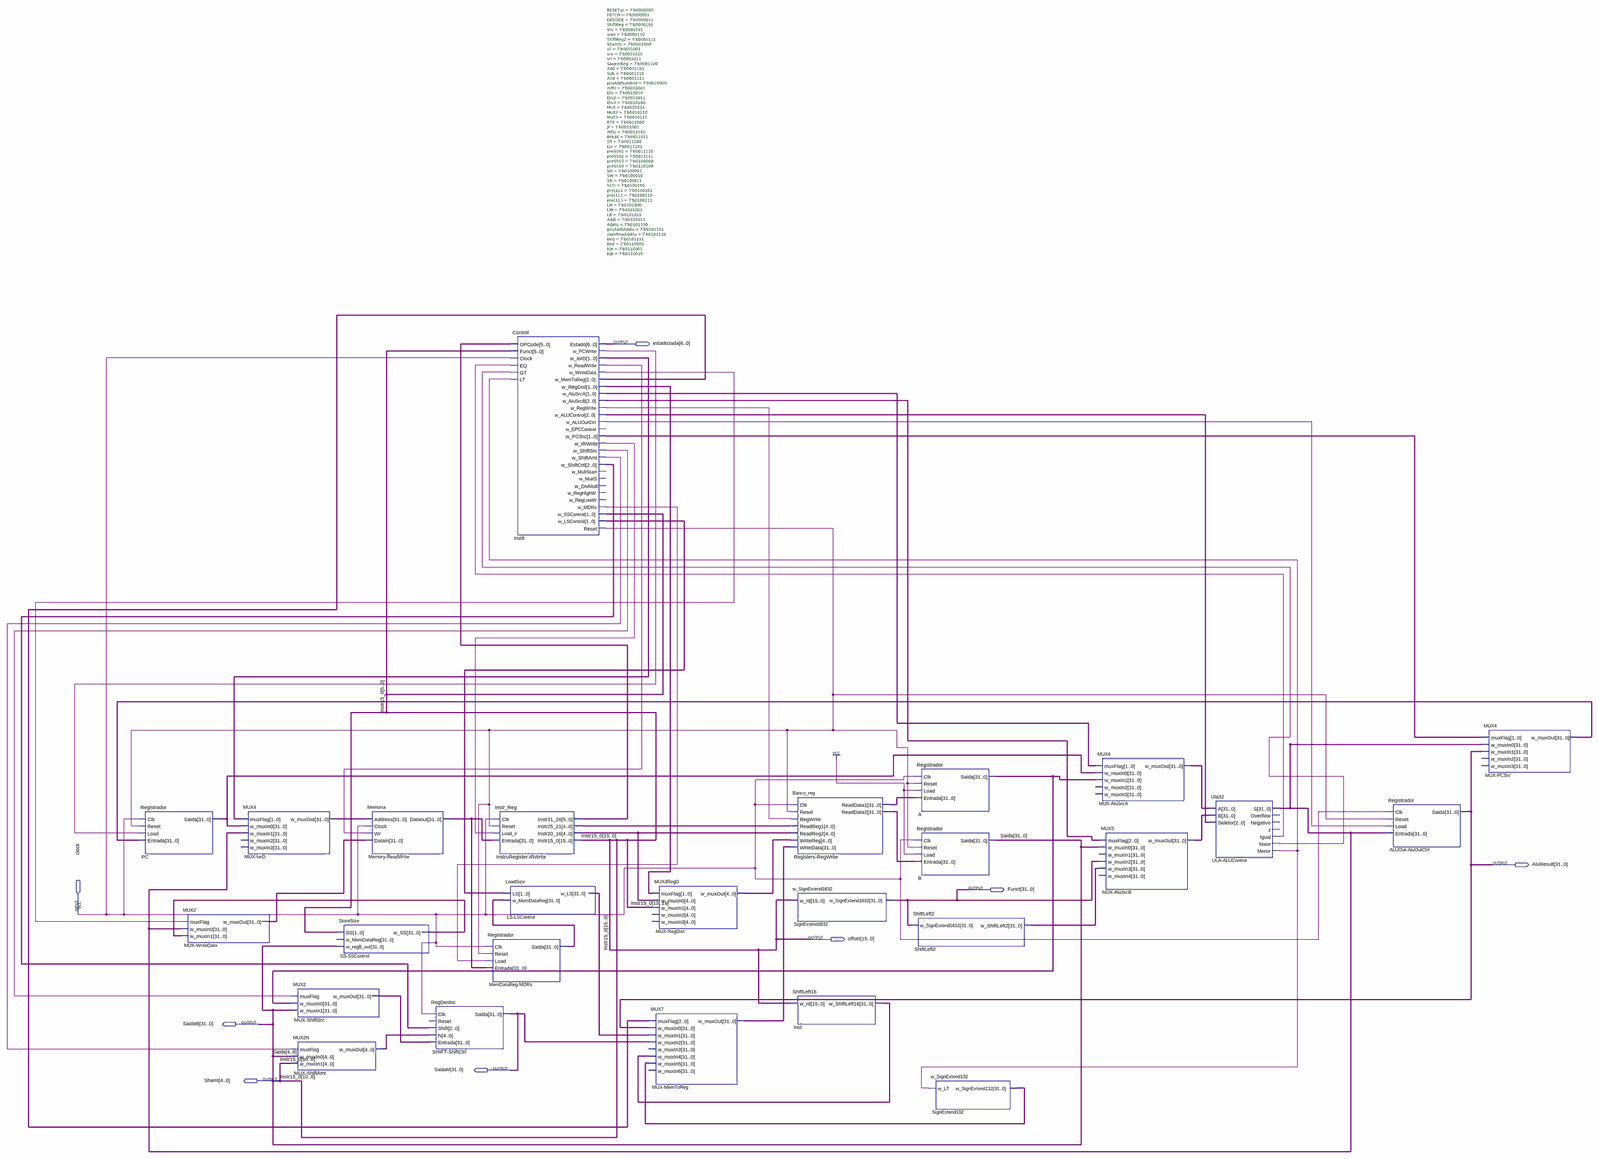
[diagram p0: schematic sheet, whole]
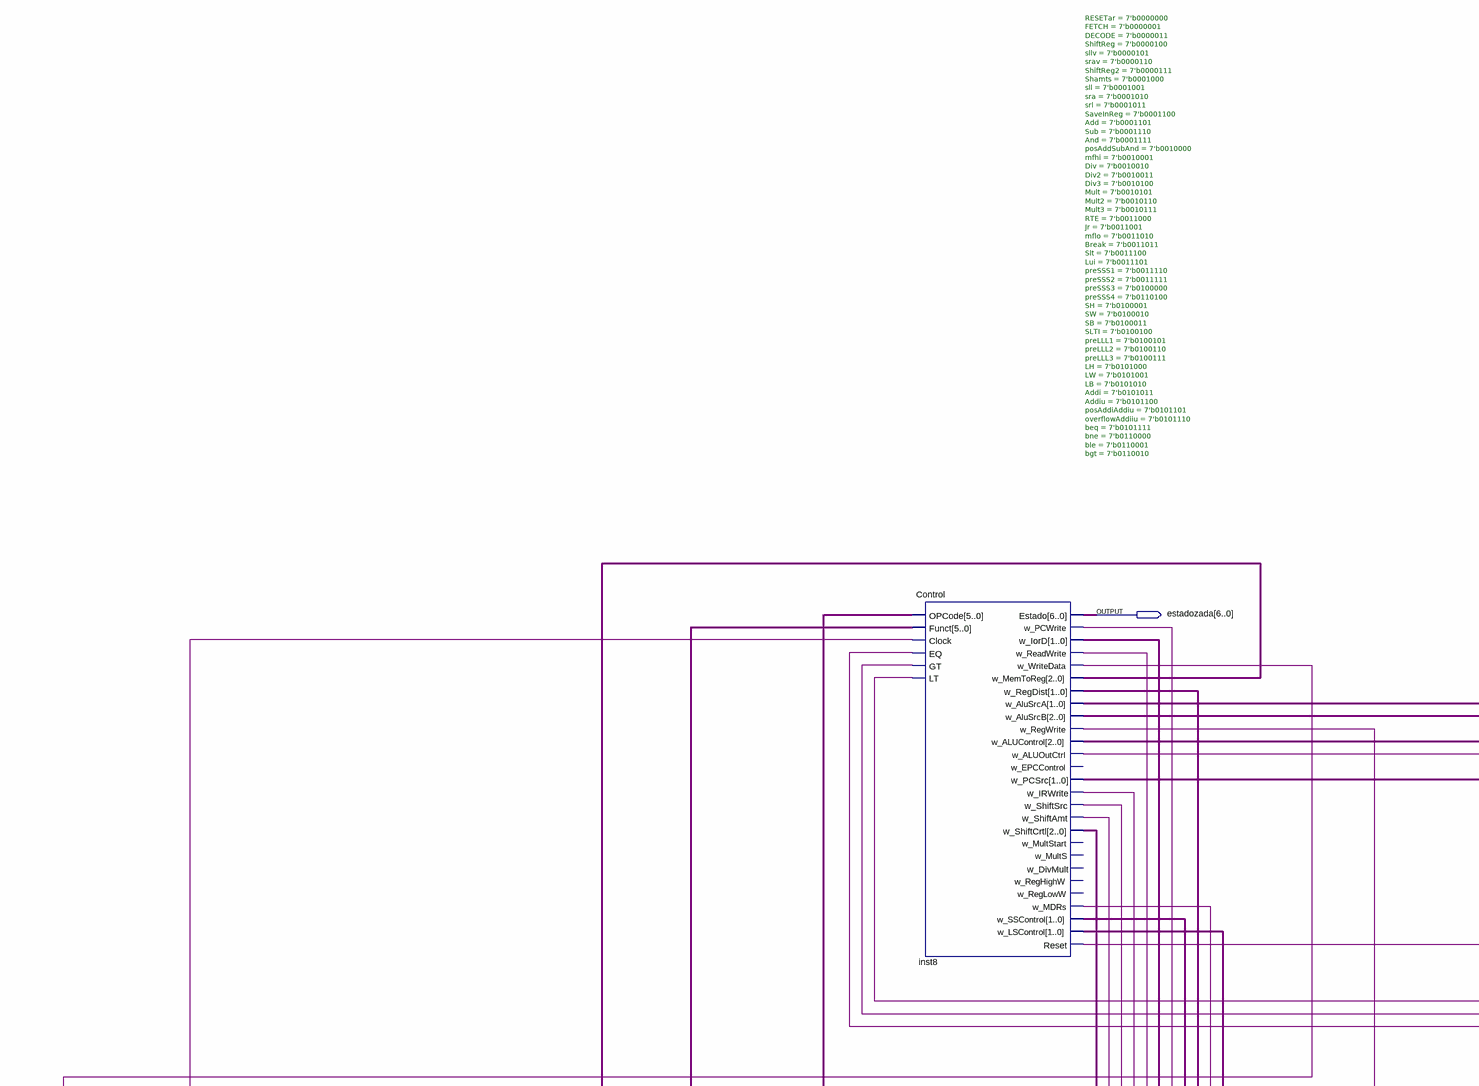
[diagram p1: schematic sheet, upper left part]
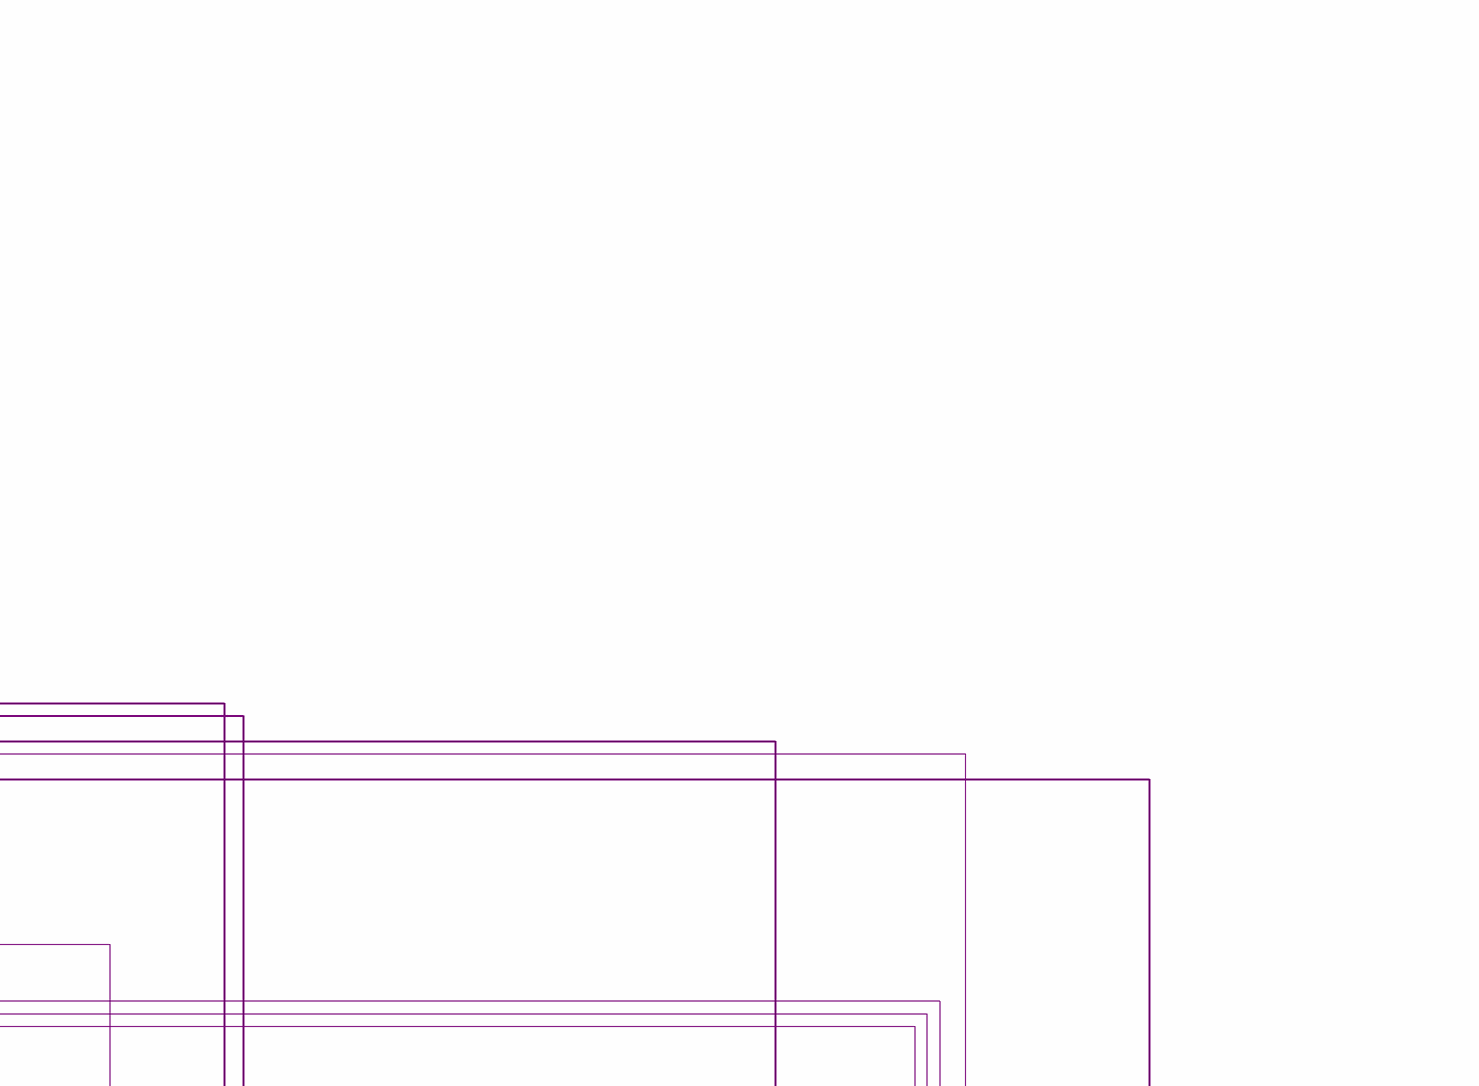
[diagram p2: schematic sheet, upper right part]
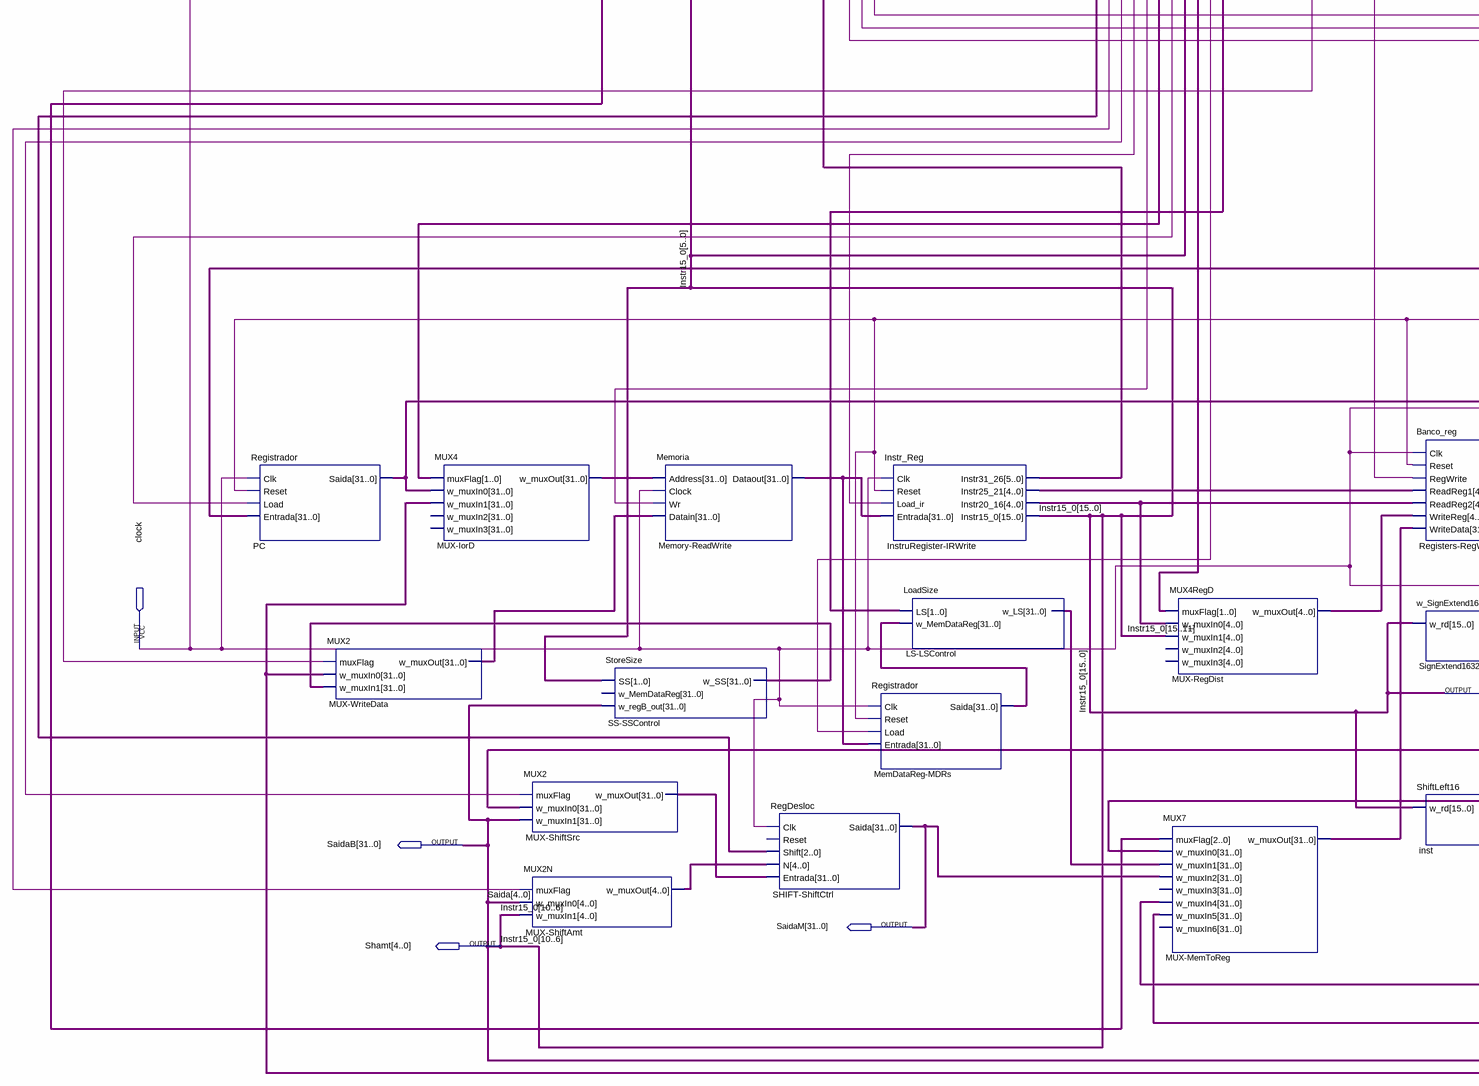
[diagram p3: schematic sheet, lower left part]
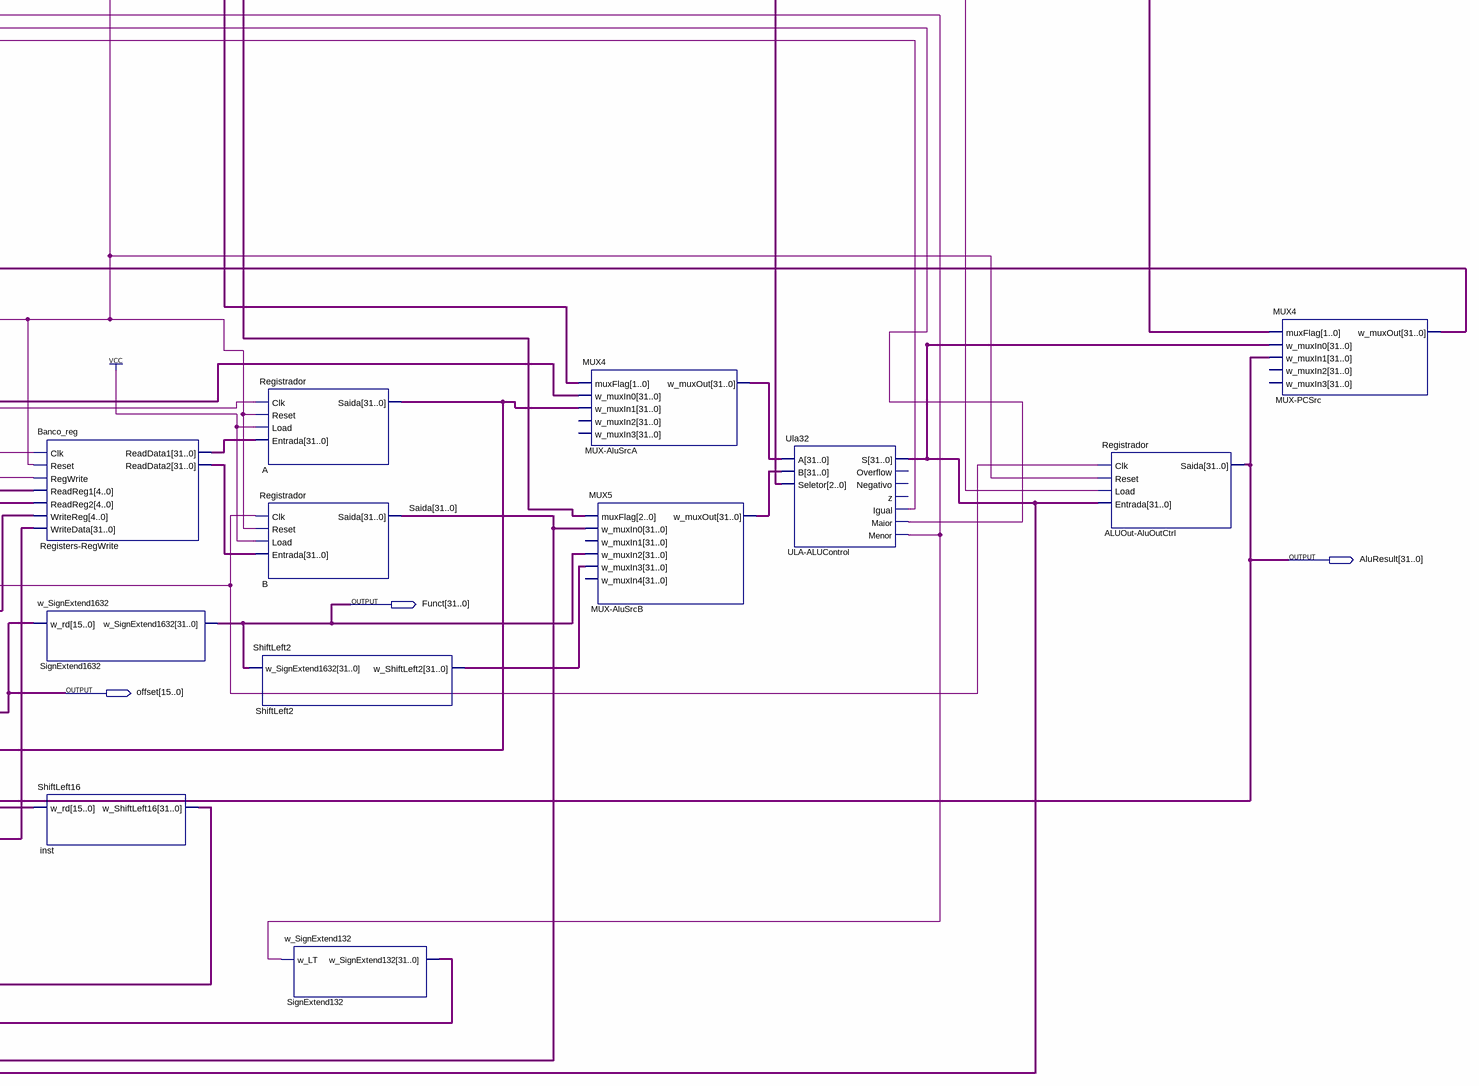
[diagram p4: schematic sheet, lower right part]
// Quartus schematic CPUbloco - Copia.bdf as structural Verilog: 26 symbols, 8 pins
module \CPUbloco_-_Copia  (
  input  clock,
  output [6:0] estadozada,
  output [31:0] AluResult,
  output [31:0] Funct,
  output [15:0] offset,
  output [31:0] SaidaB,
  output [31:0] SaidaM,
  output [4:0] Shamt
);

  wire inst8_reset, inst8_w_aluoutctrl, inst8_w_irwrite, inst8_w_mdrs, inst8_w_pcwrite, inst8_w_readwrite,
       inst8_w_regwrite, inst8_w_shiftamt, inst8_w_shiftsrc, inst8_w_writedata, ULA_ALUControl_igual,
       ULA_ALUControl_maior, ULA_ALUControl_menor;
  wire [1:0] inst8_w_alusrca, inst8_w_iord, inst8_w_lscontrol, inst8_w_pcsrc, inst8_w_regdist;
  wire [2:0] inst8_w_alucontrol, inst8_w_alusrcb, inst8_w_memtoreg, inst8_w_shiftcrtl;
  wire [4:0] InstruRegister_IRWrite_instr20_16, InstruRegister_IRWrite_instr25_21, MUX_RegDist_w_muxout,
       MUX_ShiftAmt_w_muxout;
  wire [5:0] InstruRegister_IRWrite_instr31_26;
  wire [31:0] A_saida, inst_w_shiftleft16, LS_LSControl_w_ls, MemDataReg_MDRs_saida,
       Memory_ReadWrite_dataout, MUX_AluSrcA_w_muxout, MUX_AluSrcB_w_muxout, MUX_IorD_w_muxout,
       MUX_MemToReg_w_muxout, MUX_PCSrc_w_muxout, MUX_ShiftSrc_w_muxout, MUX_WriteData_w_muxout, PC_saida,
       Registers_RegWrite_readdata1, Registers_RegWrite_readdata2, ShiftLeft2_w_shiftleft2,
       SignExtend132_w_signextend132, SS_SSControl_w_ss, ULA_ALUControl_s;

  Registrador PC (
    .Clk(clock), .Reset(inst8_reset), .Load(inst8_w_pcwrite), .Entrada(MUX_PCSrc_w_muxout), .Saida(PC_saida));
  MUX2 \MUX-WriteData  (
    .muxFlag(inst8_w_writedata), .w_muxIn0(ULA_ALUControl_s), .w_muxIn1(SS_SSControl_w_ss),
    .w_muxOut(MUX_WriteData_w_muxout));
  MUX4 \MUX-IorD  (
    .muxFlag(inst8_w_iord), .w_muxIn0(PC_saida), .w_muxIn1(ULA_ALUControl_s), .w_muxOut(MUX_IorD_w_muxout));  // open: w_muxIn2, w_muxIn3
  MUX2 \MUX-ShiftSrc  (
    .muxFlag(inst8_w_shiftsrc), .w_muxIn0(A_saida), .w_muxIn1(SaidaB), .w_muxOut(MUX_ShiftSrc_w_muxout));
  MUX2N \MUX-ShiftAmt  (
    .muxFlag(inst8_w_shiftamt), .w_muxIn0(SaidaB[4:0]), .w_muxIn1(offset[10:6]),
    .w_muxOut(MUX_ShiftAmt_w_muxout));
  StoreSize \SS-SSControl  (.SS(offset), .w_regB_out(SaidaB), .w_SS(SS_SSControl_w_ss));  // open: w_MemDataReg
  Memoria \Memory-ReadWrite  (
    .Address(MUX_IorD_w_muxout), .Clock(clock), .Wr(inst8_w_readwrite), .Datain(MUX_WriteData_w_muxout),
    .Dataout(Memory_ReadWrite_dataout));
  RegDesloc \SHIFT-ShiftCtrl  (
    .Clk(clock), .Shift(inst8_w_shiftcrtl), .N(MUX_ShiftAmt_w_muxout), .Entrada(MUX_ShiftSrc_w_muxout),
    .Saida(SaidaM));  // open: Reset
  Instr_Reg \InstruRegister-IRWrite  (
    .Clk(clock), .Reset(inst8_reset), .Load_ir(inst8_w_irwrite), .Entrada(Memory_ReadWrite_dataout),
    .Instr31_26(InstruRegister_IRWrite_instr31_26), .Instr25_21(InstruRegister_IRWrite_instr25_21),
    .Instr20_16(InstruRegister_IRWrite_instr20_16), .Instr15_0(offset));
  LoadSize \LS-LSControl  (.LS(inst8_w_lscontrol), .w_MemDataReg(MemDataReg_MDRs_saida), .w_LS(LS_LSControl_w_ls));
  Registrador \MemDataReg-MDRs  (
    .Clk(clock), .Reset(inst8_reset), .Load(inst8_w_mdrs), .Entrada(Memory_ReadWrite_dataout),
    .Saida(MemDataReg_MDRs_saida));
  Control #(.RESETar(7'b0000000), .FETCH(7'b0000001), .DECODE(7'b0000011), .ShiftReg(7'b0000100), .sllv(7'b0000101), .srav(7'b0000110), .ShiftReg2(7'b0000111), .Shamts(7'b0001000), .sll(7'b0001001), .sra(7'b0001010), .srl(7'b0001011), .SaveInReg(7'b0001100), .Add(7'b0001101), .Sub(7'b0001110), .And(7'b0001111), .posAddSubAnd(7'b0010000), .mfhi(7'b0010001), .Div(7'b0010010), .Div2(7'b0010011), .Div3(7'b0010100), .Mult(7'b0010101), .Mult2(7'b0010110), .Mult3(7'b0010111), .RTE(7'b0011000), .Jr(7'b0011001), .mflo(7'b0011010), .Break(7'b0011011), .Slt(7'b0011100), .Lui(7'b0011101), .preSSS1(7'b0011110), .preSSS2(7'b0011111), .preSSS3(7'b0100000), .preSSS4(7'b0110100), .SH(7'b0100001), .SW(7'b0100010), .SB(7'b0100011), .SLTI(7'b0100100), .preLLL1(7'b0100101), .preLLL2(7'b0100110), .preLLL3(7'b0100111), .LH(7'b0101000), .LW(7'b0101001), .LB(7'b0101010), .Addi(7'b0101011), .Addiu(7'b0101100), .posAddiAddiu(7'b0101101), .overflowAddiiu(7'b0101110), .beq(7'b0101111), .bne(7'b0110000), .ble(7'b0110001), .bgt(7'b0110010)) inst8 (
    .OPCode(InstruRegister_IRWrite_instr31_26), .Funct(offset[5:0]), .Clock(clock),
    .EQ(ULA_ALUControl_igual), .GT(ULA_ALUControl_maior), .LT(ULA_ALUControl_menor), .Estado(estadozada),
    .w_PCWrite(inst8_w_pcwrite), .w_IorD(inst8_w_iord), .w_ReadWrite(inst8_w_readwrite),
    .w_WriteData(inst8_w_writedata), .w_MemToReg(inst8_w_memtoreg), .w_RegDist(inst8_w_regdist),
    .w_AluSrcA(inst8_w_alusrca), .w_AluSrcB(inst8_w_alusrcb), .w_RegWrite(inst8_w_regwrite),
    .w_ALUControl(inst8_w_alucontrol), .w_ALUOutCtrl(inst8_w_aluoutctrl), .w_PCSrc(inst8_w_pcsrc),
    .w_IRWrite(inst8_w_irwrite), .w_ShiftSrc(inst8_w_shiftsrc), .w_ShiftAmt(inst8_w_shiftamt),
    .w_ShiftCrtl(inst8_w_shiftcrtl), .w_MDRs(inst8_w_mdrs), .w_SSControl(offset[5:0]),
    .w_LSControl(inst8_w_lscontrol), .Reset(inst8_reset));  // open: w_EPCControl, w_MultStart, w_MultS, w_DivMult, w_RegHighW, w_RegLowW
  MUX4RegD \MUX-RegDist  (
    .muxFlag(inst8_w_regdist), .w_muxIn0(InstruRegister_IRWrite_instr20_16), .w_muxIn1(offset[15:11]),
    .w_muxOut(MUX_RegDist_w_muxout));  // open: w_muxIn2, w_muxIn3
  MUX7 \MUX-MemToReg  (
    .muxFlag(inst8_w_memtoreg), .w_muxIn0(AluResult), .w_muxIn1(LS_LSControl_w_ls), .w_muxIn2(SaidaM),
    .w_muxIn4(inst_w_shiftleft16), .w_muxIn5(SignExtend132_w_signextend132), .w_muxOut(MUX_MemToReg_w_muxout));  // open: w_muxIn3, w_muxIn6
  Banco_reg \Registers-RegWrite  (
    .Clk(clock), .Reset(inst8_reset), .RegWrite(inst8_w_regwrite),
    .ReadReg1(InstruRegister_IRWrite_instr25_21), .ReadReg2(InstruRegister_IRWrite_instr20_16),
    .WriteReg(MUX_RegDist_w_muxout), .WriteData(MUX_MemToReg_w_muxout),
    .ReadData1(Registers_RegWrite_readdata1), .ReadData2(Registers_RegWrite_readdata2));
  w_SignExtend1632 SignExtend1632 (.w_rd(offset), .w_SignExtend1632(Funct));
  ShiftLeft16 inst (.w_rd(offset), .w_ShiftLeft16(inst_w_shiftleft16));
  Registrador A (
    .Clk(clock), .Reset(inst8_reset), .Load(1'b1), .Entrada(Registers_RegWrite_readdata1), .Saida(A_saida));
  Registrador B (.Clk(clock), .Reset(inst8_reset), .Load(1'b1), .Entrada(Registers_RegWrite_readdata2), .Saida(SaidaB));
  ShiftLeft2 ShiftLeft2 (.w_SignExtend1632(Funct), .w_ShiftLeft2(ShiftLeft2_w_shiftleft2));
  w_SignExtend132 SignExtend132 (.w_LT(ULA_ALUControl_menor), .w_SignExtend132(SignExtend132_w_signextend132));
  MUX4 \MUX-AluSrcA  (
    .muxFlag(inst8_w_alusrca), .w_muxIn0(PC_saida), .w_muxIn1(A_saida), .w_muxOut(MUX_AluSrcA_w_muxout));  // open: w_muxIn2, w_muxIn3
  MUX5 \MUX-AluSrcB  (
    .muxFlag(inst8_w_alusrcb), .w_muxIn0(SaidaB), .w_muxIn2(Funct), .w_muxIn3(ShiftLeft2_w_shiftleft2),
    .w_muxOut(MUX_AluSrcB_w_muxout));  // open: w_muxIn1, w_muxIn4
  Ula32 \ULA-ALUControl  (
    .A(MUX_AluSrcA_w_muxout), .B(MUX_AluSrcB_w_muxout), .Seletor(inst8_w_alucontrol), .S(ULA_ALUControl_s),
    .Igual(ULA_ALUControl_igual), .Maior(ULA_ALUControl_maior), .Menor(ULA_ALUControl_menor));  // open: Overflow, Negativo, z
  Registrador \ALUOut-AluOutCtrl  (
    .Clk(clock), .Reset(inst8_reset), .Load(inst8_w_aluoutctrl), .Entrada(ULA_ALUControl_s), .Saida(AluResult));
  MUX4 \MUX-PCSrc  (
    .muxFlag(inst8_w_pcsrc), .w_muxIn0(ULA_ALUControl_s), .w_muxIn1(AluResult), .w_muxOut(MUX_PCSrc_w_muxout));  // open: w_muxIn2, w_muxIn3

  assign Shamt = offset[10:6];

  // Other names for the same wires on the sheet: Instr15_0[15:0] = offset; Saida[31:0] = SaidaB
endmodule
